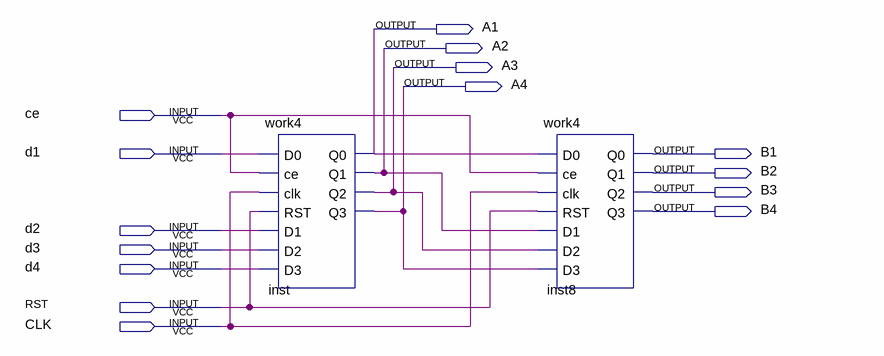
[diagram p0: schematic sheet]
// Quartus schematic work5.bdf as structural Verilog: 2 symbols, 15 pins
module work5 (
  input  ce,
  input  d1,
  input  d2,
  input  d3,
  input  d4,
  input  RST,
  input  CLK,
  output A1,
  output A2,
  output A3,
  output A4,
  output B1,
  output B2,
  output B3,
  output B4
);

  work4 inst (.D0(d1), .ce(ce), .clk(CLK), .RST(RST), .D1(d2), .D2(d3), .D3(d4), .Q0(A1), .Q1(A2), .Q2(A3), .Q3(A4));
  work4 inst8 (.D0(A1), .ce(ce), .clk(CLK), .RST(RST), .D1(A2), .D2(A3), .D3(A4), .Q0(B1), .Q1(B2), .Q2(B3), .Q3(B4));
endmodule
